# EasyEDA Pro project luoye-mainboard-2026-08-30.epro, schematic ZHUBAN
Assembly Variant: Basic; Board Name: Board1; Create Date: 2026-06-14; Page Name: P1; Project Name: AI RECORD; Schematic Name: Schematic1; Update Date: 2026-06-14; Company: 嘉立创EDA; Page Size: A4; Version: V1.0
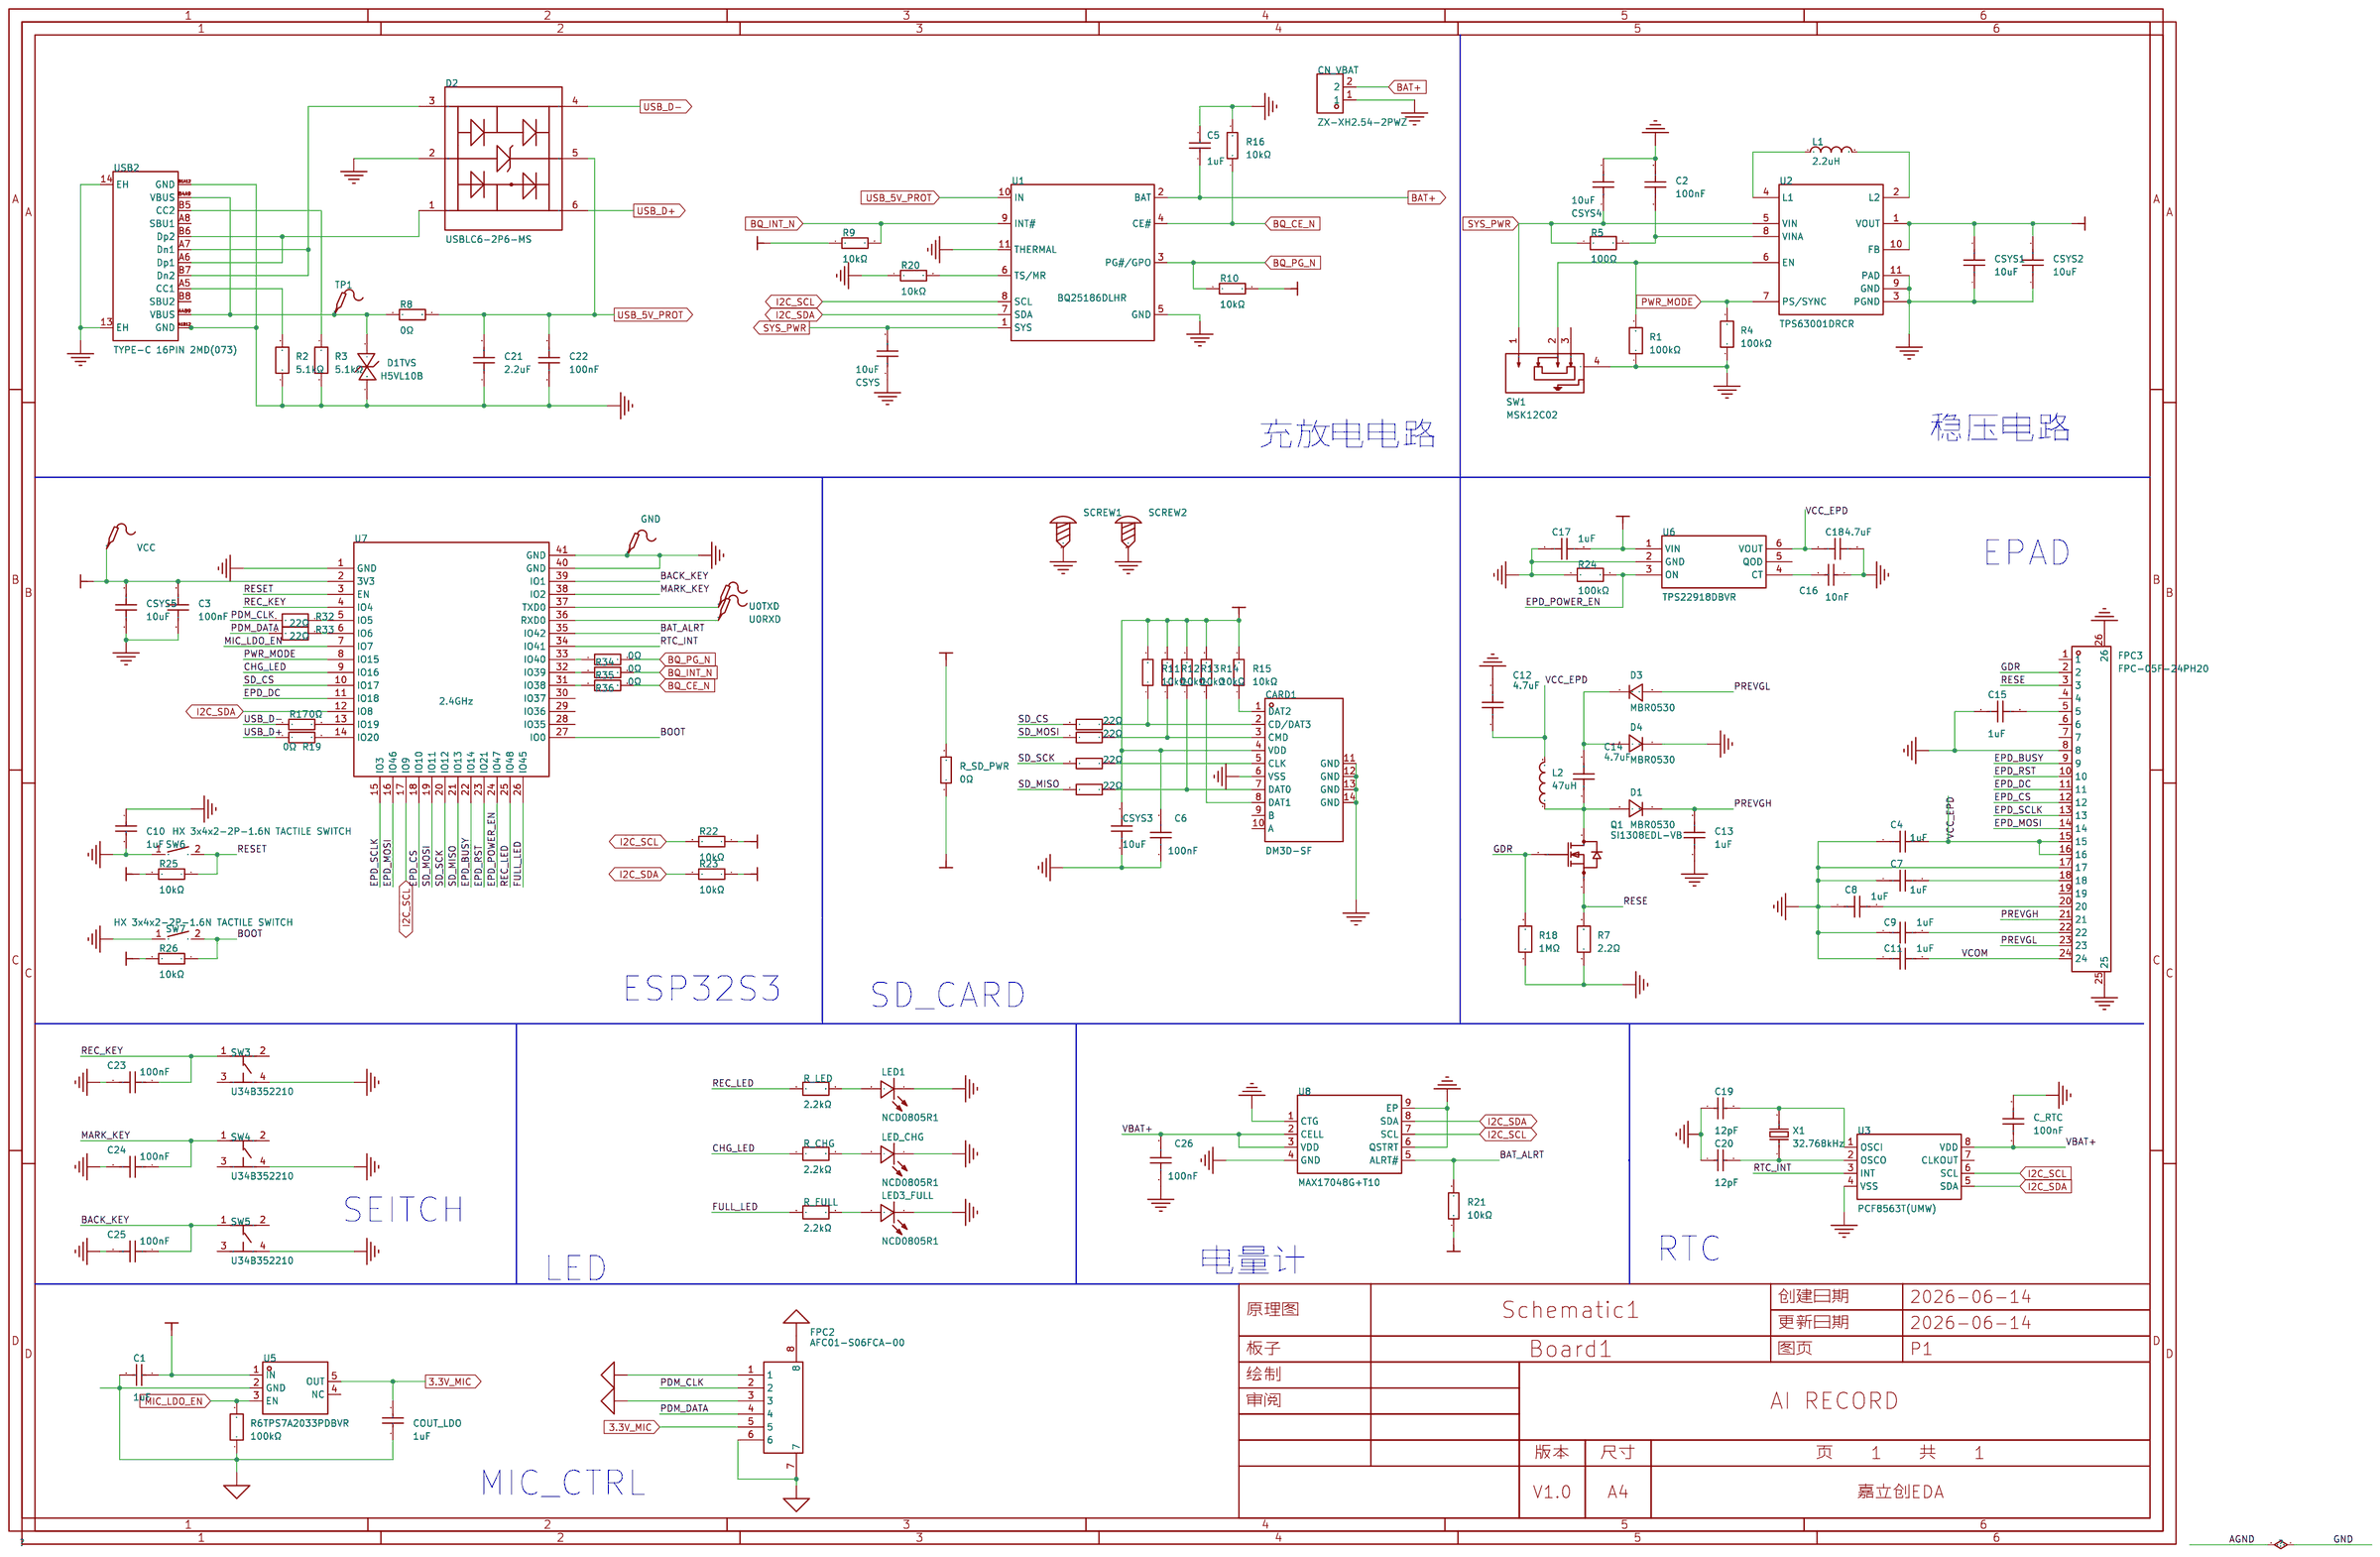
[diagram p0: schematic sheet]

## Parts
C1  1uF  [C0402]
C2  100nF  [C0402]
C3  100nF  [C0402]
C4  1uF  [C0402]
C5  1uF  [C0402]
C6  100nF  [C0402]
C7  1uF  [C0402]
C8  1uF  [C0402]
C9  1uF  [C0402]
C10  1uF  [C0402]
C11  1uF  [C0402]
C12  4.7uF  [C0402]
C13  1uF  [C0402]
C14  4.7uF  [C0402]
C15  1uF  [C0402]
C16  10nF  [C0402]
C17  1uF  [C0402]
C18  4.7uF  [C0402]
C19  12pF  [C0402]
C20  12pF  [C0402]
C21  2.2uF  [C0402]
C22  100nF  [C0402]
C23  100nF  [C0402]
C24  100nF  [C0402]
C25  100nF  [C0402]
C26  100nF  [C0402]
C_RTC  100nF  [C0402]
CARD1  DM3D-SF  [TF-SMD_DM3D-SF]
CN_VBAT  ZX-XH2.54-2PWZ  [CONN-TH_2P-P2.50_ZX-XH2.54-2PWZ]
COUT_LDO  1uF  [C0402]
CSYS  10uF  [C0603]
CSYS1  10uF  [C0603]
CSYS2  10uF  [C0603]
CSYS3  10uF  [C0603]
CSYS4  10uF  [C0603]
CSYS5  10uF  [C0603]
D1  MBR0530  [SOD-123_L2.8-W1.8-LS3.7-RD]
D1TVS  H5VL10B  [SOD-882_L1.0-W0.6-BI]
D2  USBLC6-2P6-MS  [SOT-666-6_L1.6-W1.2-P0.50-LS1.6-BL]
D3  MBR0530  [SOD-123_L2.8-W1.8-LS3.7-RD]
D4  MBR0530  [SOD-123_L2.8-W1.8-LS3.7-RD]
FPC2  AFC01-S06FCA-00  [FPC-SMD_P0.50-6P_AFC01-S06FCA-00]
FPC3  FPC-05F-24PH20  [FPC-SMD_24P-P0.50_FPC-05F-24PH20]
GND  -  [Test-Point-0.5mm]
L1  2.2uH  [IND-SMD_L4.0-W4.0]
L2  47uH  [IND-SMD_L4.0-W4.0]
LED1  NCD0805R1  [LED0805-RD]
LED3_FULL  NCD0805R1  [LED0805-RD]
LED_CHG  NCD0805R1  [LED0805-RD]
Q1  SI1308EDL-VB  [SOT-323_L2.0-W1.3-P1.30-LS2.1-BR]
R1  100kΩ  [R0402]
R2  5.1kΩ  [R0402]
R3  5.1kΩ  [R0402]
R4  100kΩ  [R0402]
R5  100Ω  [R0402]
R6  100kΩ  [R0402]
R7  2.2Ω  [R0603]
R8  0Ω  [R0402]
R9  10kΩ  [R0402]
R10  10kΩ  [R0402]
R11  10kΩ  [R0402]
R12  10kΩ  [R0402]
R13  10kΩ  [R0402]
R14  10kΩ  [R0402]
R15  10kΩ  [R0402]
R16  10kΩ  [R0402]
R17  0Ω  [R0402]
R18  1MΩ  [R0603]
R19  0Ω  [R0402]
R20  10kΩ  [R0402]
R21  10kΩ  [R0402]
R22  10kΩ  [R0402]
R23  10kΩ  [R0402]
R24  100kΩ  [R0603]
R25  10kΩ  [R0402]
R26  10kΩ  [R0402]
R32  22Ω  [R0402]
R33  22Ω  [R0402]
R34  0Ω  [R0402]
R35  0Ω  [R0402]
R36  0Ω  [R0402]
R_CHG  2.2kΩ  [R0402]
R_FULL  2.2kΩ  [R0402]
R_LED  2.2kΩ  [R0402]
R_SD_PWR  0Ω  [R0402]
SCREW1  -  [M2螺丝]
SCREW2  -  [M2螺丝]
SD_CS  22Ω  [R0402]
SD_MISO  22Ω  [R0402]
SD_MOSI  22Ω  [R0402]
SD_SCK  22Ω  [R0402]
SW1  MSK12C02  [SW-TH_MSK12C02]
SW3  U34B352210  [SW-SMD_4P-L3.7-W3.7-P2.70-LS3.7]
SW4  U34B352210  [SW-SMD_4P-L3.7-W3.7-P2.70-LS3.7]
SW5  U34B352210  [SW-SMD_4P-L3.7-W3.7-P2.70-LS3.7]
SW6  HX 3x4x2-2P-1.6N TACTILE SWITCH  [KEY-SMD_L4.0-W3.0-LS4.9-1]
SW7  HX 3x4x2-2P-1.6N TACTILE SWITCH  [KEY-SMD_L4.0-W3.0-LS4.9-1]
TP1  -  [Test-Point-0.5mm]
U0RXD  -  [Test-Point-0.5mm]
U0TXD  -  [Test-Point-0.5mm]
U1  BQ25186DLHR  [WSON-10_L2.2-W2.0-P0.40-BL-EP_TI_DLH0010A]
U2  TPS63001DRCR  [VSON-10_L3.0-W3.0-P0.50-TL-EP_TPS62410DRCR]
U3  PCF8563T(UMW)  [SOP-8_L4.9-W3.9-P1.27-LS6.0-BL]
U5  TPS7A2033PDBVR  [SOT-23-5_L2.9-W1.6-P0.95-LS2.8-BR]
U6  TPS22918DBVR  [SOT-23-6_L2.9-W1.6-P0.95-LS2.8-BR]
U7  2.4GHz  [WIRELM-SMD_ESP32-S3-WROOM-1U]
U8  MAX17048G+T10  [TDFN-8_L2.0-W2.0-P0.50-BL-EP1.2]
USB2  TYPE-C 16PIN 2MD(073)  [USB-C-SMD_TYPE-C-16PIN-2MD-073]
VCC  -  [Test-Point-0.5mm]
X1  32.768kHz  [FC-135R_L3.2-W1.5]

## Library data of the parts
C1 C5 C10 COUT_LDO = CL05A105KO5NNNC: 容值:1uF;精度:±10%;额定电压:16V;温度系数:X5R;; LCSC Part Name: 1uF ±10% 16V; Supplier Part: C29266; Manufacturer: SAMSUNG(三星); Supplier Footprint: 0402; JLCPCB Part Class: Extended Part; Datasheet: https://item.szlcsc.com/datasheet/CL05A105KO5NNNC/30018.html; Supplier: LCSC; Tolerance: ±10%; Voltage Rating: 16V; Temperature Coefficient: X5R
C2 C3 C6 C23-C26 C_RTC = CL05B104KO5NNNC: 容值:100nF;精度:±10%;额定电压:16V;温度系数:X7R;; LCSC Part Name: 100nF ±10% 16V; Supplier Part: C1525; Manufacturer: SAMSUNG(三星); Supplier Footprint: 0402; JLCPCB Part Class: Basic Part; Datasheet: https://item.szlcsc.com/datasheet/CL05B104KO5NNNC/1877.html; Supplier: LCSC; Tolerance: ±10%; Voltage Rating: 16V; Temperature Coefficient: X7R
C4 C7-C9 C11 C13 C15 C17 = CL05A105KA5NQNC: 容值:1uF;精度:±10%;额定电压:25V;温度系数:X5R;; LCSC Part Name: 1uF ±10% 25V; Supplier Part: C52923; Manufacturer: SAMSUNG(三星); Supplier Footprint: 0402; JLCPCB Part Class: Basic Part; Datasheet: https://item.szlcsc.com/datasheet/CL05A105KA5NQNC/53938.html; Supplier: LCSC; Tolerance: ±10%; Voltage Rating: 25V; Temperature Coefficient: X5R
C12 C14 C18 = CL05A475KP5NRNC: 容值:4.7uF;精度:±10%;额定电压:10V;温度系数:X5R;; LCSC Part Name: 4.7uF ±10% 10V; Supplier Part: C368809; Manufacturer: SAMSUNG(三星); Supplier Footprint: 0402; JLCPCB Part Class: Extended Part; Datasheet: https://item.szlcsc.com/datasheet/CL05A475KP5NRNC/342854.html; Supplier: LCSC; Tolerance: ±10%; Voltage Rating: 10V; Temperature Coefficient: X5R
C16 = CL05B103KB5NNNC: 容值:10nF;精度:±10%;额定电压:50V;温度系数:X7R;; LCSC Part Name: 10nF ±10% 50V; Supplier Part: C15195; Manufacturer: SAMSUNG(三星); Supplier Footprint: 0402; JLCPCB Part Class: Basic Part; Datasheet: https://item.szlcsc.com/datasheet/CL05B103KB5NNNC/15869.html; Supplier: LCSC; Tolerance: ±10%; Voltage Rating: 50V; Temperature Coefficient: X7R
C19 C20 = CC0402JRNPO9BN120: 容值:12pF;精度:±5%;额定电压:50V;温度系数:NP0;; LCSC Part Name: 12pF ±5% 50V; Supplier Part: C106201; Manufacturer: YAGEO(国巨); Supplier Footprint: 0402; JLCPCB Part Class: Extended Part; Datasheet: https://item.szlcsc.com/datasheet/CC0402JRNPO9BN120/107416.html; Supplier: LCSC; Tolerance: ±5%; Voltage Rating: 50V; Temperature Coefficient: NP0
C21 = GRM155Z71A225KE01D: 容值:2.2uF;精度:±10%;额定电压:10V;温度系数:X7R;; LCSC Part Name: 2.2uF ±10% 10V; Supplier Part: C2997286; Manufacturer: muRata(村田); Supplier Footprint: 0402; JLCPCB Part Class: Extended Part; Datasheet: https://item.szlcsc.com/datasheet/GRM155Z71A225KE01D/3468099.html; Supplier: LCSC; Tolerance: ±10%; Voltage Rating: 10V; Temperature Coefficient: X7R
C22 = GRM155R71H104KE14D: 容值:100nF;精度:±10%;额定电压:50V;温度系数:X7R;; LCSC Part Name: 100nF ±10% 50V; Supplier Part: C77020; Manufacturer: muRata(村田); Supplier Footprint: 0402; JLCPCB Part Class: Extended Part; Datasheet: https://item.szlcsc.com/datasheet/GRM155R71H104KE14D/78147.html; Supplier: LCSC; Tolerance: ±10%; Voltage Rating: 50V; Temperature Coefficient: X7R
CARD1 = DM3D-SF: 卡连接方式:拔插式;卡类型:MicroSD卡(TF卡);连接器类型:卡座;本体最大高度:1.55mm;工作温度:-25℃~+85℃;; LCSC Part Name: 拔插式 MicroSD卡(TF卡) 卡座; Supplier Part: C719027; Manufacturer: HRS(广濑); Supplier Footprint: SMD; JLCPCB Part Class: Extended Part; Datasheet: https://item.szlcsc.com/datasheet/DM3D-SF/761653.html; Supplier: LCSC; Card Connection Mode: 拔插式; Card Type: MicroSD卡(TF卡); Connector Type: 卡座; Additional Card Detection Pins: 无; Height Above Board: 1.55mm; Operating Temperature: -25℃~+85℃
CN_VBAT = ZX-XH2.54-2PWZ: 插针结构:1x2P;间距:2.5mm;安装方式:弯插;参考系列:XH;总PIN数:2P;排数:1;每排PIN数:2;行距:-;额定电流:2A;触头材质:黄铜;触头镀层:锡;工作温度:-25℃~+85℃;; LCSC Part Name: 1x2P 间距:2.5mm 弯插 系列:XH; Supplier Part: C7429641; Manufacturer: Megastar(兆星); Supplier Footprint: 弯插,P=2.5mm; JLCPCB Part Class: Extended Part; Datasheet: https://item.szlcsc.com/datasheet/ZX-XH2.54-2PWZ/8427558.html; Supplier: LCSC; Pins Structure: 1x2P; Pitch: 2.5mm; Mounting Type: 弯插; Reference Series: XH; Number of Pins: 2P; Number of Rows: 1; Number of PINs Per Row: 2; Current Rating: 2A; Contact Material: 黄铜; Contact Plating: 锡; Operating Temperature: -25℃~+85℃; Voltage Rating: 250V; Plastic Material: PA66; Flame Retardant Rating: UL94V-0; Color: 白色; Z-Height of the Board: 5.9mm; X-Length of Bottom Edge on Board (Spacing Line): 7.5mm; Y-Width of Bottom Edge on Board: 7.32mm
CSYS CSYS1-CSYS5 = HGC0603R5106M160NTHJ: 容值:10uF;精度:±20%;额定电压:16V;温度系数:X5R;; LCSC Part Name: 10uF ±20% 16V; Supplier Part: C7472959; Manufacturer: Chinocera(华瓷); Supplier Footprint: 0603; JLCPCB Part Class: Extended Part; Datasheet: https://item.szlcsc.com/datasheet/HGC0603R5106M160NTHJ/8532806.html; Supplier: LCSC; Tolerance: ±20%; Voltage Rating: 16V; Temperature Coefficient: X5R
D1 D3 D4 = MBR0530_C77336: 二极管配置:-;正向压降(Vf):550mV@500mA;直流反向耐压(Vr):30V;整流电流:500mA;; LCSC Part Name: 电压:30V 电流:500mA; Supplier Part: C77336; Manufacturer: CJ(江苏长电/长晶); Supplier Footprint: SOD-123; JLCPCB Part Class: Extended Part; Datasheet: https://item.szlcsc.com/datasheet/MBR0530/78464.html; Supplier: LCSC; Voltage - Forward(Vf@If): 550mV@500mA; Voltage - DC Reverse(Vr): 30V; Current - Rectified: 500mA; Reverse Leakage Current (Ir): 80uA@30V; Non-Repetitive Peak Forward Surge Current: 5.5A
D1TVS = H5VL10B: 极性:双向;反向截止电压(Vrwm):5V;钳位电压:10V;峰值脉冲电流(Ipp):5A;峰值脉冲功率(Ppp):50W;击穿电压:5.6V;; LCSC Part Name: 丝印 PB 双向ESD 5V截止 峰值浪涌电流：5A; Supplier Part: C7420372; Manufacturer: R+O(宏嘉诚); Supplier Footprint: DFN1006-2L; JLCPCB Part Class: Extended Part; Datasheet: https://item.szlcsc.com/datasheet/H5VL10B/8397194.html; Supplier: LCSC; Polarity: 双向; Reverse Stand-Off Voltage (Vrwm): 5V; Clamping Voltage: 10V; Peak Pulse Current (Ipp): 5A; Peak Pulse Power Dissipation (Ppp): 50W; Voltage - Breakdown: 5.6V; Reverse Leakage Current (Ir): 100nA; Number of Channels: 单路; Operating Temperature: -55℃~+125℃; level of protection: IEC 61000-4-2；IEC 61000-4-5; Type: ESD; Junction Capacitance: 15pF
D2 = USBLC6-2P6-MS: 反向截止电压(Vrwm):5V;钳位电压:30V;峰值脉冲电流(Ipp):4A;峰值脉冲功率(Ppp):120W;击穿电压:6V;; LCSC Part Name: 丝印F 静电放电（ESD）、瞬态电压抑制器（TVS）、晶闸管浪涌抑制器（TSS）、金属氧化物压敏电阻（MOV）、气体放电管（GDT）、聚合物静电放电二极管（PLED）; Supplier Part: C3647099; Manufacturer: MSKSEMI(美森科); Supplier Footprint: SOT-666; JLCPCB Part Class: Extended Part; Datasheet: https://item.szlcsc.com/datasheet/USBLC6-2P6-MS/4214195.html; Supplier: LCSC; Reverse Stand-Off Voltage (Vrwm): 5V; Clamping Voltage: 30V; Peak Pulse Current (Ipp): 4A; Peak Pulse Power Dissipation (Ppp): 120W; Voltage - Breakdown: 6V; Reverse Leakage Current (Ir): 1uA; level of protection: IEC 61000-4-4；IEC 61000-4-2; Type: ESD; Junction Capacitance: 0.9pF
FPC2 = AFC01-S06FCA-00: 锁定特性:翻盖式;触点类型:下接;触点数量:6P;间距:0.5mm;安装类型:卧贴;; LCSC Part Name: 间距:0.5mm P数:6P 翻盖式 下接; Supplier Part: C262655; Manufacturer: JS(钜硕电子); Supplier Footprint: SMD,P=0.5mm,卧贴; JLCPCB Part Class: Extended Part; Datasheet: https://atta.szlcsc.com/upload/public/pdf/source/20190816/C413942_2A72D1AC756EAE17EEDF756A339D4500.pdf; Supplier: LCSC; Locking Feature: 翻盖式; Contact Type: 下接; Number of Contacts: 6P; Pitch: 0.5mm; Mounting Type: 卧贴; FFC, FCB Thickness: 0.3mm; Height Above Board: 2mm
FPC3 = FPC-05F-24PH20: 锁定特性:翻盖式;触点类型:卧贴;触点数量:24P;间距:0.5mm;安装方式:下接;工作温度:-25℃~+85℃;; LCSC Part Name: 翻盖式 卧贴 P数:24P 间距:0.5mm; Supplier Part: C2856805; Manufacturer: XUNPU(讯普); Supplier Footprint: SMD,P=0.5mm,卧贴; JLCPCB Part Class: Extended Part; Datasheet: https://item.szlcsc.com/datasheet/FPC-05F-24PH20/3056903.html; Supplier: LCSC; Locking Feature: 翻盖式; Contact Type: 卧贴; Number of Contacts: 24P; Pitch: 0.5mm; Mounting Type: 下接; FFC, FCB Thickness: 0.3mm; Height Above Board: 2mm; Contact Material: 磷青铜; Contact Plating: 锡; Operating Temperature: -25℃~+85℃; Rated Voltage (Max): 50V; Current Rating (Max): 500mA
GND TP1 U0RXD U0TXD VCC = Test-Point: Test Point 测试点
L1 = SPH4018H2R2MT: 电感值:2.2uH;精度:±20%;额定电流:2.2A;饱和电流(Isat):3A;类型:-;; LCSC Part Name: 2.2uH ±20% 3A; Supplier Part: C370436; Manufacturer: Sunlord(顺络); Supplier Footprint: SMD,4x4mm; JLCPCB Part Class: Extended Part; Datasheet: https://item.szlcsc.com/datasheet/SPH4018H2R2MT/344187.html; Supplier: LCSC; Tolerance: ±20%; Current Rating: 2.2A; Current - Saturation(Isat): 3A; DC Resistance(DCR): 42mΩ
L2 = MNR4012T470MT: 电感值:47uH;精度:±20%;饱和电流(Isat):500mA;; LCSC Part Name: 47uH ±20% 500mA 温升电流：0.5A; Supplier Part: C18222004; Manufacturer: MetalLions(美铼); Supplier Footprint: SMD,4x4mm; JLCPCB Part Class: Extended Part; Datasheet: https://item.szlcsc.com/datasheet/MNR4012T470MT/19405550.html; Supplier: LCSC; Tolerance: ±20%; Current - Saturation(Isat): 500mA; DC Resistance(DCR): 1.1Ω
LED1 LED3_FULL LED_CHG = NCD0805R1: 灯头类型:-;发光颜色:红色;正向压降(Vf):1.6V~2.6V;功率:65mW;正向电流:25mA;波长:615nm~630nm;二极管配置:独立二极管;透镜颜色:-;色温:-;发光强度:195mcd;发光角度:130°;载带方式:-;工作温度:-30℃~+85℃;; LCSC Part Name: 片式发光二极管; Supplier Part: C84256; Manufacturer: 国星光电; Supplier Footprint: 0805; JLCPCB Part Class: Basic Part; Datasheet: https://item.szlcsc.com/datasheet/NCD0805R1/85425.html; Supplier: LCSC; Illumination Color: 红色; Voltage - Forward(Vf): 1.6V~2.6V; Power(Watts): 65mW; Forward Current: 25mA; Wavelength - Dominant: 615nm~630nm; Peak Wavelength: 630nm; Diode Configuration: 独立二极管; Luminous Intensity: 195mcd; Viewing Angle: 130°; Operating Temperature: -30℃~+85℃
Q1 = SI1308EDL-VB: 数量:1个N沟道;漏源电压(Vdss):20V;连续漏极电流(Id):4A;导通电阻(RDS(on)):36mΩ@10V；40mΩ@4.5V；48mΩ@2.5V;耗散功率(Pd):2.8W;阈值电压(Vgs(th)):1.3V@250uA;; LCSC Part Name: 1个N沟道 耐压:20V 电流:4A; Supplier Part: C4355112; Manufacturer: VBsemi(微碧半导体); Supplier Footprint: SOT-323(SC-70); JLCPCB Part Class: Extended Part; Datasheet: https://item.szlcsc.com/datasheet/SI1308EDL-VB/4925635.html; Supplier: LCSC; Number: 1个N沟道; Drain to Source Voltage: 20V; Current - Continuous Drain(Id): 4A; RDS(on): 36mΩ@10V；40mΩ@4.5V；48mΩ@2.5V; Pd - Power Dissipation: 2.8W; Gate Threshold Voltage (Vgs(th)): 1.3V@250uA; Gate Charge(Qg): 8.8nC@10V; Operating Temperature: -55℃~+150℃; Type: N沟道
R1 R4 R6 = RT0402BRD07100KL: 电阻类型:薄膜电阻;阻值:100kΩ;精度:±0.1%;功率:62.5mW;最大工作电压:50V;温度系数:±25ppm/℃;; LCSC Part Name: 薄膜电阻 100kΩ ±0.1% 62.5mW; Supplier Part: C852472; Manufacturer: YAGEO(国巨); Supplier Footprint: 0402; JLCPCB Part Class: Extended Part; Datasheet: https://atta.szlcsc.com/upload/public/pdf/source/20210326/C852472_6283D268A9C33EA67274729CC55E28B1.pdf; Supplier: LCSC; Type: 薄膜电阻; Tolerance: ±0.1%; Power(Watts): 62.5mW; Overload Voltage (Max): 50V; Temperature Coefficient: ±25ppm/℃; Operating Temperature Range: -55℃~+155℃
R2 R3 = RT0402BRD075K1L: 电阻类型:薄膜电阻;阻值:5.1kΩ;精度:±0.1%;功率:62.5mW;工作电压:50V;温度系数:±25ppm/℃;; LCSC Part Name: 薄膜电阻 5.1kΩ ±0.1% 62.5mW; Supplier Part: C852856; Manufacturer: YAGEO(国巨); Supplier Footprint: 0402; JLCPCB Part Class: Extended Part; Datasheet: https://atta.szlcsc.com/upload/public/pdf/source/20210609/C852856_90E10C82268A77A57ACC56DCA8718567.pdf; Supplier: LCSC; Type: 薄膜电阻; Tolerance: ±0.1%; Power(Watts): 62.5mW; Voltage-Supply(Max): 50V; Temperature Coefficient: ±25ppm/℃; Operating Temperature: -55℃~+155℃
R5 = RT0402BRD07100RL: 电阻类型:薄膜电阻;阻值:100Ω;精度:±0.1%;功率:62.5mW;工作电压:50V;温度系数:±25ppm/℃;; LCSC Part Name: 薄膜电阻 100Ω ±0.1% 62.5mW; Supplier Part: C705627; Manufacturer: YAGEO(国巨); Supplier Footprint: 0402; JLCPCB Part Class: Extended Part; Datasheet: https://item.szlcsc.com/datasheet/RT0402BRD07100RL/742147.html; Supplier: LCSC; Type: 薄膜电阻; Tolerance: ±0.1%; Power(Watts): 62.5mW; Voltage-Supply(Max): 50V; Temperature Coefficient: ±25ppm/℃; Operating Temperature: -55℃~+155℃
R7 = FRC0603J2R2TS: 电阻类型:厚膜电阻;阻值:2.2Ω;精度:±5%;功率:100mW;工作电压:75V;温度系数:±200ppm/℃;; LCSC Part Name: 2.2Ω ±5% 100mW 厚膜电阻; Supplier Part: C2930032; Manufacturer: FOJAN(富捷); Supplier Footprint: 0603; JLCPCB Part Class: Extended Part; Supplier: LCSC; Type: 厚膜电阻; Tolerance: ±5%; Power(Watts): 100mW; Voltage-Supply(Max): 75V; Temperature Coefficient: ±200ppm/℃; Operating Temperature: -55℃~+155℃
R8 R17 R19 R34-R36 R_SD_PWR = ERJ2GE0R00X: 电阻类型:厚膜电阻;阻值:0Ω;功率:100mW;工作电压:-;温度系数:-100ppm/℃~+600ppm/℃;; LCSC Part Name: 0Ω 100mW 厚膜电阻; Supplier Part: C242160; Manufacturer: PANASONIC(松下); Supplier Footprint: 0402; JLCPCB Part Class: Extended Part; Datasheet: https://item.szlcsc.com/datasheet/ERJ2GE0R00X/241006.html; Supplier: LCSC; Type: 厚膜电阻; Power(Watts): 100mW; Temperature Coefficient: -100ppm/℃~+600ppm/℃; Operating Temperature: -55℃~+155℃
R9-R16 R20-R23 R25 R26 = RT0402BRD0710KL: 电阻类型:薄膜电阻;阻值:10kΩ;精度:±0.1%;功率:62.5mW;工作电压:50V;温度系数:±25ppm/℃;; LCSC Part Name: 薄膜电阻 10kΩ ±0.1% 62.5mW; Supplier Part: C190095; Manufacturer: YAGEO(国巨); Supplier Footprint: 0402; JLCPCB Part Class: Extended Part; Datasheet: https://item.szlcsc.com/datasheet/RT0402BRD0710KL/208478.html; Supplier: LCSC; Type: 薄膜电阻; Tolerance: ±0.1%; Power(Watts): 62.5mW; Voltage-Supply(Max): 50V; Temperature Coefficient: ±25ppm/℃; Operating Temperature: -55℃~+155℃
R18 = FRC0603J105 TS: 电阻类型:厚膜电阻;阻值:1MΩ;精度:±5%;功率:100mW;工作电压:75V;温度系数:±100ppm/℃;; LCSC Part Name: 1MΩ ±5% 100mW 厚膜电阻; Supplier Part: C2907115; Manufacturer: FOJAN(富捷); Supplier Footprint: 0603; JLCPCB Part Class: Extended Part; Supplier: LCSC; Type: 厚膜电阻; Tolerance: ±5%; Power(Watts): 100mW; Voltage-Supply(Max): 75V; Temperature Coefficient: ±100ppm/℃; Operating Temperature: -55℃~+155℃
R24 = FRC0603F1003TS: 电阻类型:厚膜电阻;阻值:100kΩ;精度:±1%;功率:100mW;工作电压:75V;温度系数:±100ppm/℃;; LCSC Part Name: 100kΩ ±1% 100mW 厚膜电阻; Supplier Part: C2906980; Manufacturer: FOJAN(富捷); Supplier Footprint: 0603; JLCPCB Part Class: Extended Part; Supplier: LCSC; Type: 厚膜电阻; Tolerance: ±1%; Power(Watts): 100mW; Voltage-Supply(Max): 75V; Temperature Coefficient: ±100ppm/℃; Operating Temperature: -55℃~+155℃
R32 R33 = FRC0402F22R0TS: 电阻类型:厚膜电阻;阻值:22Ω;精度:±1%;功率:62.5mW;工作电压:50V;温度系数:±100ppm/℃;; LCSC Part Name: 22Ω ±1% 62.5mW 厚膜电阻; Supplier Part: C2929994; Manufacturer: FOJAN(富捷); Supplier Footprint: 0402; JLCPCB Part Class: Extended Part; Datasheet: https://item.szlcsc.com/datasheet/FRC0402F22R0TS/3266927.html; Supplier: LCSC; Type: 厚膜电阻; Tolerance: ±1%; Power(Watts): 62.5mW; Voltage-Supply(Max): 50V; Temperature Coefficient: ±100ppm/℃; Operating Temperature: -55℃~+155℃
R_CHG R_FULL R_LED = FRC0402F2201TS: 电阻类型:厚膜电阻;阻值:2.2kΩ;精度:±1%;功率:62.5mW;工作电压:50V;温度系数:±100ppm/℃;; LCSC Part Name: 2.2kΩ ±1% 62.5mW 厚膜电阻; Supplier Part: C2906865; Manufacturer: FOJAN(富捷); Supplier Footprint: 0402; JLCPCB Part Class: Extended Part; Datasheet: https://item.szlcsc.com/datasheet/FRC0402F2201TS/3180378.html; Supplier: LCSC; Type: 厚膜电阻; Tolerance: ±1%; Power(Watts): 62.5mW; Voltage-Supply(Max): 50V; Temperature Coefficient: ±100ppm/℃; Operating Temperature: -55℃~+155℃
SCREW1 SCREW2 = M2螺丝: Supplier Footprint: 插件
SD_CS SD_MISO SD_MOSI SD_SCK = RC0402FR-0722RL: 电阻类型:厚膜电阻;阻值:22Ω;精度:±1%;功率:62.5mW;最大工作电压:50V;温度系数:±100ppm/℃;; LCSC Part Name: 厚膜电阻 22Ω ±1% 62.5mW; Supplier Part: C114765; Manufacturer: YAGEO(国巨); Supplier Footprint: 0402; JLCPCB Part Class: Extended Part; Datasheet: https://atta.szlcsc.com/upload/public/pdf/source/20180821/C275644_0D56F95EFF785E7D9A1FEF436B37DA78.pdf; Supplier: LCSC; Type: 厚膜电阻; Tolerance: ±1%; Power(Watts): 62.5mW; Overload Voltage (Max): 50V; Temperature Coefficient: ±100ppm/℃; Operating Temperature Range: -55℃~+155℃
SW1 = MSK12C02: 电路结构:单刀双掷;安装方式:卧贴;开关颜色:-;额定电流:50mA;额定电压:12V;工作寿命:1万次;; LCSC Part Name: MSK12C02 白柄1.5编带; Supplier Part: C431540; Manufacturer: SHOU HAN(首韩); Supplier Footprint: SMD,8x2.8mm; JLCPCB Part Class: Extended Part; Datasheet: https://item.szlcsc.com/datasheet/MSK12C02/427897.html; Supplier: LCSC; Circuit: 单刀双掷; Termination Style: SMD接片; Length: 8mm; Width: 2.8mm; Switch Height: 1.4mm; Mounting Type: 卧贴; Current Rating: 50mA; Voltage Rating: 12V; Life: 1万次; Operating Temperature: -20℃~+70℃
SW3-SW5 = U34B352210: 电路结构:单刀单掷;按钮形状:圆形按钮;作用力:2.6N;安装方式:-;开关长度:3.7mm;开关宽度:3.7mm;开关高度:0.35mm;触点电流:50mA;额定电压:12V;带灯:无;工作寿命:10万次;; LCSC Part Name: 3.7*3.7*0.35四脚平贴带三点薄膜轻触开关260gf; Supplier Part: C41416707; Manufacturer: SAMZO(三佐); Supplier Footprint: SMD-4P,3.7x3.7mm; Datasheet: https://item.szlcsc.com/datasheet/U34B352210/43240513.html; Supplier: LCSC; Circuit: 单刀单掷; Actuator Style: 圆形按钮; Operating Force: 2.6N; Length: 3.7mm; Width: 3.7mm; Switch Height: 0.35mm; Contact Current: 50mA; Voltage Rating: 12V; With Lamp: 无; Life: 10万次; Operating Temperature: -25℃~+85℃
SW6 SW7 = HX 3x4x2-2P-1.6N TACTILE SWITCH: 电路结构:单刀单掷;按钮形状:圆形按钮;作用力:1.6N;安装方式:立贴;开关长度:4mm;开关宽度:3mm;开关高度:2mm;带支架:不带支架;触点电流:50mA;额定电压:12V;带灯:无;工作寿命:10万次;; LCSC Part Name: 4*3*2mm 立贴 轻触开关; Supplier Part: C49234124; Manufacturer: hanxia(韩下); Supplier Footprint: SMD; JLCPCB Part Class: Extended Part; Datasheet: https://item.szlcsc.com/datasheet/HX%25203x4x2-2P-1.6N%2520TACTILE%2520SWITCH/51650185.html; Supplier: LCSC; Circuit: 单刀单掷; Actuator Style: 圆形按钮; Operating Force: 1.6N; Mounting Type: 立贴; Length: 4mm; Width: 3mm; Switch Height: 2mm; with Bracket: 不带支架; Contact Current: 50mA; Voltage Rating: 12V; Actuator/Cap Color: 黑色; With Lamp: 无; Termination Style: SMD接片; Life: 10万次
U1 = BQ25186DLHR_C44639442: 工作电压:3.6V~18V;最大充电电流:1A;电池类型:磷酸铁锂电池；锂电池;电池节数:1;; Supplier Part: C44639442; Manufacturer: TI(德州仪器); Supplier Footprint: WSON-10; JLCPCB Part Class: Extended Part; Datasheet: https://www.ti.com.cn/cn/lit/ds/symlink/bq25186.pdf; Supplier: LCSC; The Chip Type: 充电芯片; Voltage - Supply: 3.6V~18V; Charge Current - Max: 1A; Charging Saturation Voltage: 4.65V; End-Off Voltage: 2V; Type of Battery: 磷酸铁锂电池；锂电池; Number of Cells: 1; Operating Temperature: -40℃~+125℃; Battery Temperature Detection: 支持; 0V Battery Charge: 支持; Supply Current (Iq): 15nA; Interface: I2C
U2 = TPS63001DRCR: 功能类型:升降压型;工作电压:1.8V~5.5V;输出电压:3.3V;输出电流:1.2A;输出类型:固定;; LCSC Part Name: 升降压型 1.8V~5.5V; Supplier Part: C28060; Manufacturer: TI(德州仪器); Supplier Footprint: VSON-10-EP(3x3); JLCPCB Part Class: Extended Part; Datasheet: https://www.ti.com/cn/lit/gpn/tps63001; Supplier: LCSC; Function: 升降压型; Voltage - Supply: 1.8V~5.5V; Output Voltage: 3.3V; Output Current: 1.2A; Frequency - Switching: 1.5MHz; Operating Temperature: -40℃~+85℃@(TA); Synchronous Rectifier: 是; Number of Outputs: 1; Topology: 降压-升压式; Quiescent Current: 50uA; Switch tube (built-in/external): 内置; Output Type: 固定; Features: 轻载高效模式；频率同步；过流保护；负载断开
U3 = PCF8563T(UMW): 接口类型:I2C;晶振:外置;闹钟输出:有;; LCSC Part Name: 实时时钟; Supplier Part: C22396389; Manufacturer: UMW(友台半导体); Supplier Footprint: SOP-8; JLCPCB Part Class: Extended Part; Datasheet: https://item.szlcsc.com/datasheet/PCF8563T(UMW)/24000860.html; Supplier: LCSC; Interface: I2C; Voltage - Supply: 1V~5.5V; Current - Supply: 250nA; crystal oscillator: 外置; Alarm Output: 有; Operating Temperature: -40℃~+85℃; Quiescent Current(Iq): 0.25uA
U5 = TPS7A2033PDBVR: 输出类型:固定;最大输入电压:6V;输出电压:3.3V;输出电流:300mA;输出极性:正极;; LCSC Part Name: 具有高 PSRR 的 300mA、超低噪声、低 IQ、低压降 (LDO) 线性稳压器; Supplier Part: C2862740; Manufacturer: TI(德州仪器); Supplier Footprint: SOT-23-5; JLCPCB Part Class: Extended Part; Datasheet: https://www.ti.com/cn/lit/gpn/tps7a20; Supplier: LCSC; Output Type: 固定; Maximum Input Voltage: 6V; Output Voltage: 3.3V; Output Current: 300mA; Dropout Voltage: 140mV@(300mA); standby current: 15uA; Feature: 防静电保护；软启动；浪涌保护；低ESR；热保护(TSD)；欠压闭锁；过流保护(OCP)；带使能；防倒灌; Operating Temperature: -40℃~+125℃@(Tj); Output Polarity: 正极; Number of Outputs: 1
U6 = TPS22918DBVR: 类型:负载开关;通道数:1;输入控制逻辑:高电平有效;工作电压:1V~5.5V;最大连续电流:2A;导通电阻:53mΩ;; LCSC Part Name: 5.5V、2A、导通电阻的负载开关; Supplier Part: C131941; Manufacturer: TI(德州仪器); Supplier Footprint: SOT-23-6; JLCPCB Part Class: Extended Part; Datasheet: https://www.ti.com/cn/lit/gpn/tps22918; Supplier: LCSC; Type: 负载开关; Number of Channels: 1; Control Input Logic: 高电平有效; Voltage - Supply: 1V~5.5V; Maximum Continuous Current: 2A; RDS(on): 53mΩ; Features: 集成电荷泵；输出放电功能；软启动; Operating Temperature	-: -40℃~+105℃
U7 = ESP32-S3-WROOM-1U-N16R8: 核心芯片:ESP32-S3R8;频率:2.4GHz;发射功率:20.5dBm;接收灵敏度:-103.5dBm;; LCSC Part Name: 不带固件 2.4GHz Wi-Fi (802.11b/g/n) + 蓝牙 5 (LE) 模组; Supplier Part: C3013946; Manufacturer: ESPRESSIF(乐鑫); Supplier Footprint: SMD,19.2x18mm; JLCPCB Part Class: Extended Part; Datasheet: https://item.szlcsc.com/datasheet/ESP32-S3-WROOM-1U-N16R8/3522416.html; Supplier: LCSC; Utilized IC / Part: ESP32-S3R8; Wireless Standard: Bluetooth5.0; Interface Type: I2C；GPIO；JTAG；UART；SPI；PWM；SDIO；ADC；USB；I2S; Output Power: 20.5dBm; Voltage - Supply: 3V~3.6V; Receive  Current: 95mA; Send  Current: 355mA; Sensitivity: -103.5dBm; Operating Temperature: -40℃~+65℃
U8 = MAX17048G+T10: 工作电压:2.5V~4.5V;最大充电电流:-;电池类型:锂电池;电池节数:1;; LCSC Part Name: 3uA单节/双节电池电量计，带ModelGauge算法; Supplier Part: C2682616; Manufacturer: ADI(亚德诺)/MAXIM(美信); Supplier Footprint: DFN-8-EP(2x2); JLCPCB Part Class: Extended Part; Datasheet: https://item.szlcsc.com/datasheet/MAX17048G%252BT10/2777647.html; Supplier: LCSC; The Chip Type: 监测芯片; Voltage - Supply: 2.5V~4.5V; Type of Battery: 锂电池; Number of Cells: 1; Operating Temperature: -40℃~+85℃; Battery Temperature Detection: 不支持; 0V Battery Charge: 不支持; Supply Current (Iq): 3uA; Interface: I2C
USB2 = TYPE-C 16PIN 2MD(073): 连接器类型:Type-C;协议标准:-;公母:母;安装方式:卧贴;触点数量:16P;端口数量:1;额定电流 - 电源:3A;工作温度:-25℃~+85℃;; LCSC Part Name: Type-C 母 卧贴; Supplier Part: C2765186; Manufacturer: SHOU HAN(首韩); Supplier Footprint: SMD; JLCPCB Part Class: Extended Part; Datasheet: https://item.szlcsc.com/datasheet/TYPE-C%252016PIN%25202MD(073)/2901843.html; Supplier: LCSC; Connector Type: Type-C; Gender: 母; Mounting Type: 卧贴; Number of Contacts: 16P; Number of Ports: 1; Current Rating-Power: 3A; Voltage Rating: 5V; Connect-Disconnect Life: 1万次; Detection color: 黑色; Operating Temperature: -25℃~+85℃
X1 = Q13FC13500004_C32346: 晶振类型:贴片晶振;频率:32.768kHz;常温频差:±20ppm;负载电容:12.5pF;; LCSC Part Name: 32.768kHz ±20ppm 12.5pF; Supplier Part: C32346; Manufacturer: EPSON(爱普生); Manufacturer Part: Q13FC13500004; Supplier Footprint: SMD3215-2P; JLCPCB Part Class: Basic Part; Datasheet: https://item.szlcsc.com/datasheet/Q13FC13500004/33310.html; Supplier: LCSC; Type: 贴片晶振; Normal temperature Frequency Tolerance: ±20ppm; Load Capacitance: 12.5pF; Equivalent Series Resistance(ESR): 70kΩ; Operating Temperature: -40℃~+85℃

## Nets
3.3V_MIC: COUT_LDO.2 FPC2.5 U5.5(OUT)
AGND: C1.2 C2.2 C3.1 C4.1 C5.2 C6.1 C7.1 C8.1 C9.1 C10.1 C10.2 C11.1 C12.2 C13.1 C15.2 C16.1 C17.1 C18.1 C19.1 C20.1 C21.1 C22.1 C23.2 C24.2 C25.2 C26.1 C_RTC.2 CARD1.6(VSS) CARD1.11(GND) CARD1.12(GND) CARD1.13(GND) CARD1.14(GND) CN_VBAT.1 COUT_LDO.1 CSYS.1 CSYS1.1 CSYS2.1 CSYS3.1 CSYS4.2 CSYS5.1 D1TVS.1(C) D2.2 D4.1(C) FPC2.1 FPC2.3 FPC2.6 FPC2.7 FPC2.8 FPC3.8 FPC3.17 FPC3.25 FPC3.26 GND.1 LED1.1(-) LED3_FULL.1(-) LED_CHG.1(-) R1.1 R2.1 R3.2 R4.1 R6.1 R7.1 R16.2 R18.1 R20.1 R24.1 SCREW1.1 SCREW2.1 SW1.4 SW3.4 SW4.4 SW5.4 SW6.1 SW7.1 U1.5(GND) U1.11(THERMAL) U2.3(PGND) U2.9(GND) U2.11(PAD) U3.4(VSS) U5.2(GND) U6.2(GND) U7.1(GND) U7.40(GND) U7.41(GND) U8.1(CTG) U8.4(GND) U8.6(QSTRT) U8.9(EP) USB2.13(EH) USB2.14(EH) USB2.A1B12(GND) USB2.B1A12(GND)
VBAT+: C26.2 C_RTC.1 U3.8(VDD) U8.2(CELL) U8.3(VDD)
VCC: C1.1 C3.2 C17.2 CSYS1.2 CSYS2.2 CSYS5.2 R9.1 R10.2 R21.1 R22.1 R23.1 R25.2 R26.2 R_SD_PWR.1 U2.1(VOUT) U2.10(FB) U5.1(IN) U6.1(VIN) U7.2(3V3) VCC.1
VCC_EPD: C4.2 C12.1 C18.2 FPC3.15 FPC3.16 L2.2 U6.6(VOUT)
VCC_SD: C6.2 CARD1.4(VDD) CSYS3.2 R11.2 R12.2 R13.2 R14.2 R15.2 R_SD_PWR.2
BACK_KEY: C25.1 SW5.1 U7.39(IO1)
BAT+: C5.1 CN_VBAT.2 U1.2(BAT)
BAT_ALRT: R21.2 U7.35(IO42) U8.5(ALRT#)
BOOT: R26.1 SW7.2 U7.27(IO0)
BQ_CE_N: R16.1 R36.2 U1.4(CE#)
BQ_INT_N: R9.2 R35.2 U1.9(INT#)
BQ_PG_N: R10.1 R34.2 U1.3(PG#/GPO)
CHG_LED: R_CHG.1 U7.9(IO16)
EPD_BUSY: FPC3.9 U7.22(IO14)
EPD_CS: FPC3.12 U7.18(IO10)
EPD_DC: FPC3.11 U7.11(IO18)
EPD_MOSI: FPC3.14 U7.16(IO46)
EPD_POWER_EN: R24.2 U6.3(ON) U7.24(IO47)
EPD_RST: FPC3.10 U7.23(IO21)
EPD_SCLK: FPC3.13 U7.15(IO3)
FULL_LED: R_FULL.1 U7.26(IO45)
GDR: FPC3.2 Q1.1(G) R18.2
I2C_SCL: R22.2 U1.8(SCL) U3.6(SCL) U7.17(IO9) U8.7(SCL)
I2C_SDA: R23.2 U1.7(SDA) U3.5(SDA) U7.12(IO8) U8.8(SDA)
MARK_KEY: C24.1 SW4.1 U7.38(IO2)
MIC_LDO_EN: R6.2 U5.3(EN) U7.7(IO7)
PDM_CLK: FPC2.2 R32.2
PDM_DATA: FPC2.4 R33.2
PREVGH: C13.2 D1.1(C) FPC3.21
PREVGL: D3.2(A) FPC3.23
PWR_MODE: R4.2 U2.7(PS/SYNC) U7.8(IO15)
REC_KEY: C23.1 SW3.1 U7.4(IO4)
REC_LED: R_LED.1 U7.25(IO48)
RESE: FPC3.3 Q1.2(S) R7.2
RESET: R25.1 SW6.2 U7.3(EN)
RTC_INT: U3.3(INT) U7.34(IO41)
SD_CS: SD_CS.1 U7.10(IO17)
SD_MISO: SD_MISO.1 U7.21(IO13)
SD_MOSI: SD_MOSI.1 U7.19(IO11)
SD_SCK: SD_SCK.1 U7.20(IO12)
SYS_PWR: CSYS.2 CSYS4.1 R5.1 SW1.1 U1.1(SYS) U2.5(VIN)
USB_5V_PROT: C21.2 C22.2 D2.5 R8.2 U1.10(IN)
USB_D+: D2.6 R19.1
USB_D-: D2.4 R17.1
VCOM: C11.2 FPC3.24
$1N2: D1TVS.2(A) R8.1 TP1.1 USB2.A4B9(VBUS) USB2.B4A9(VBUS)
$1N5: D2.1 USB2.A6(Dp1) USB2.B6(Dp2)
$1N6: D2.3 USB2.A7(Dn1) USB2.B7(Dn2)
$1N18: R2.2 USB2.A5(CC1)
$1N43: R1.2 SW1.2 U2.6(EN)
$1N49: C2.1 R5.2 U2.8(VINA)
$1N50: L1.1 U2.4(L1)
$1N51: L1.2 U2.2(L2)
$1N121: CARD1.2(CD/DAT3) R11.1 SD_CS.2
$1N122: CARD1.3(CMD) R12.1 SD_MOSI.2
$1N123: CARD1.5(CLK) SD_SCK.2
$1N125: CARD1.1(DAT2) R15.1
$1N127: CARD1.7(DAT0) R13.1 SD_MISO.2
$1N184: C7.2 FPC3.18
$1N185: C8.2 FPC3.20
$1N188: C9.2 FPC3.22
$1N199: C14.2 D3.1(C) D4.2(A)
$1N200: C14.1 D1.2(A) L2.1 Q1.3(D)
$1N212: C15.1 FPC3.5
$1N218: C16.2 U6.4(CT)
$1N241: CARD1.8(DAT1) R14.1
$1N256: C20.2 U3.2(OSCO) X1.1
$1N257: C19.2 U3.1(OSCI) X1.2
$1N288: LED1.2(+) R_LED.2
$1N294: LED_CHG.2(+) R_CHG.2
$1N297: LED3_FULL.2(+) R_FULL.2
$1N309: R20.2 U1.6(TS/MR)
$1N348: U0RXD.1 U7.36(RXD0)
$1N355: U0TXD.1 U7.37(TXD0)
$1N383: R32.1 U7.5(IO5)
$1N385: R33.1 U7.6(IO6)
$1N388: R34.1 U7.33(IO40)
$1N390: R35.1 U7.32(IO39)
$1N392: R36.1 U7.31(IO38)
$1N397: R17.2 U7.13(IO19)
$1N398: R19.2 U7.14(IO20)
$1N405: R3.1 USB2.B5(CC2)

Not connected (* = marked no-connect by the designer): CARD1 9(B) 10(A); FPC3 1 4 6 7 19; SW1 3; SW3 2 3; SW4 2 3; SW5 2 3; U3 7(CLKOUT); U5 4(NC); U6 5(QOD); U7 28(IO35) 29(IO36) 30(IO37); USB2 A8(SBU1) B8(SBU2)

## Notes on the sheet
- 稳压电路
- 充放电电路
- EPAD
- ESP32S3
- SD_CARD
- SEITCH
- RTC
- LED
- 电量计
- MIC_CTRL
